# Altium schematic sheet TopLevel.SCHDOC
size A4
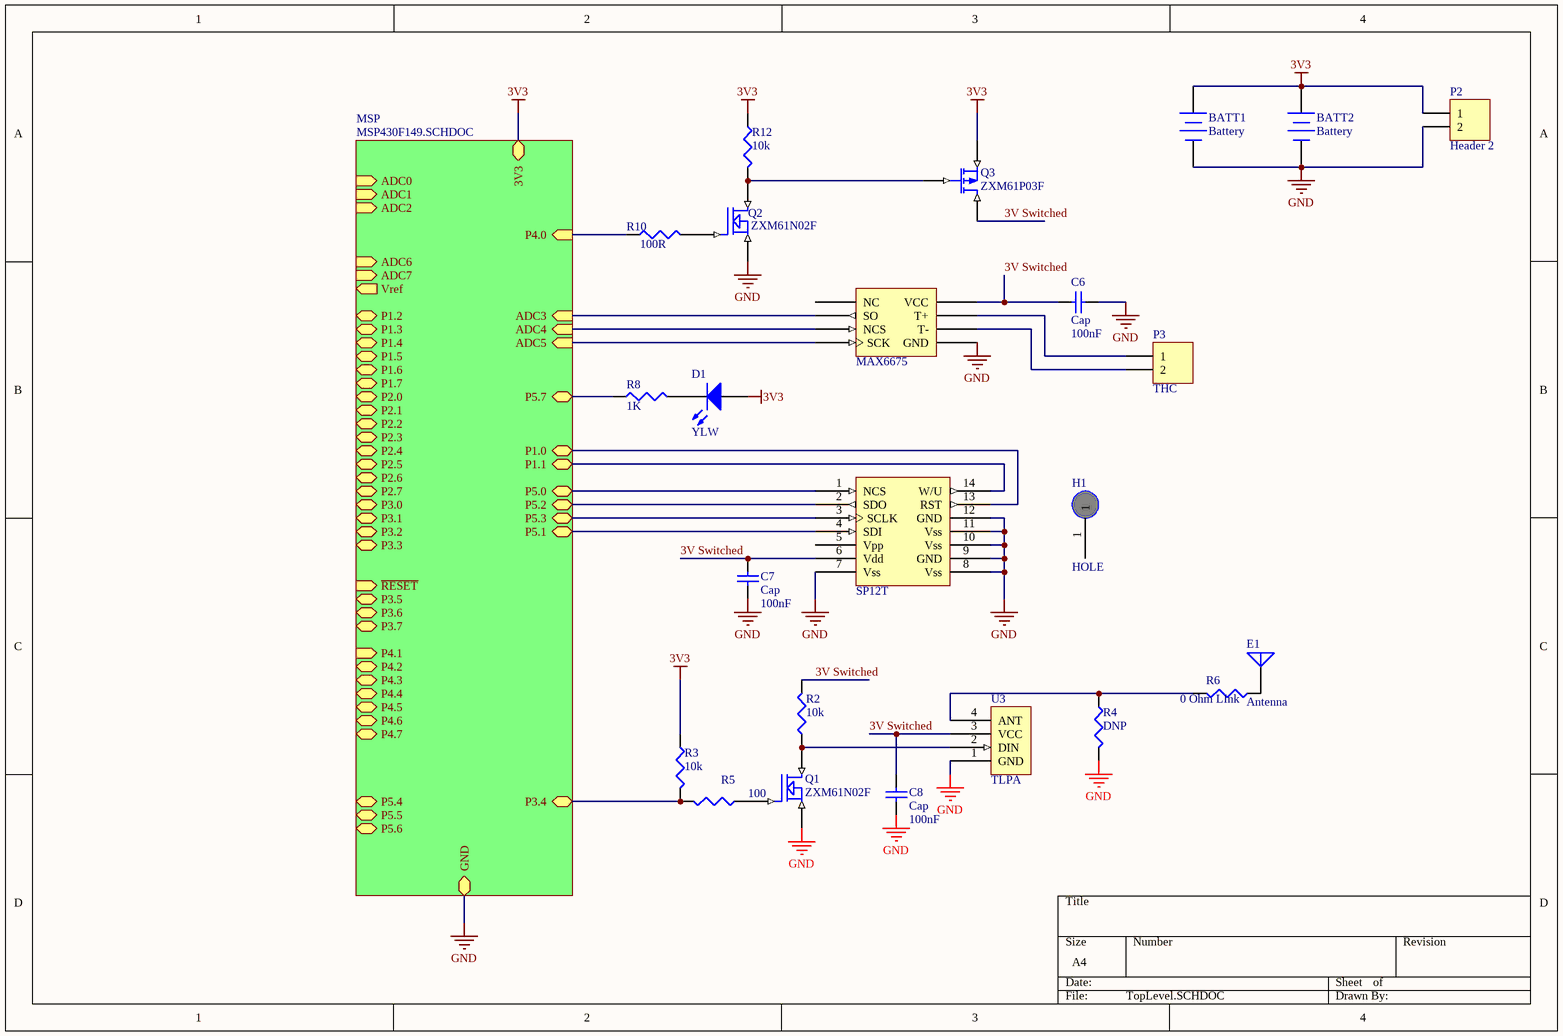
[diagram p0: TopLevel.SCHDOC]

## Parts
BATT1  Battery  [Keystone CR1632 Holder]
BATT2  Battery  [Keystone CR1632 Holder]
C6  Cap  value 100nF  [1608[0603]]
C7  Cap  value 100nF  [1608[0603]]
C8  Cap  value 100nF  [1608[0603]]
D1  YLW  [2012[0805]]
E1  Antenna  [PIN1]
H1  HOLE  [M2.5]
MAX6675  MAX6675  [SO8]  (value not drawn)
P2  Header 2  [HDR1X2]
P3  THC  [HDR1X2]
Q1  ZXM61N02F  [SOT23]
Q2  ZXM61N02F  [SOT23-3]
Q3  ZXM61P03F  [SOT23-3]
R2  10k  [1608[0603]]
R3  10k  [1608[0603]]
R4  DNP  [1608[0603]]
R5  100  [1608[0603]]
R6  0 Ohm LInk  [1608[0603]]
R8  1K  [1608[0603]]
R10  100R  [1608[0603]]
R12  10k  [1608[0603]]
SP12T  SP12T  [SOP14]  (value not drawn)
U3  TLPA  [TLPA Flat]

## Sub-sheets
MSP = MSP430F149.SCHDOC: GND, 3V3, ADC0 (in), ADC1 (in), ADC2 (in), ADC3 (in), ADC4 (in), ADC5 (in), ADC6 (in), ADC7 (in), P1.0, P1.1, P1.2, P1.3, P1.4, P1.5, P1.6, P1.7, P2.0, P2.1, P2.2, P2.3, P2.4, P2.5, P2.6, P2.7, P3.0, P3.1, P3.2, P3.3, P3.4, Vref (out), ~{RESET} (in), P3.5, P3.6, P3.7, P4.0 (in), P4.1 (in), P4.2, P4.3, P4.4, P4.5, P4.6, P4.7, P5.0, P5.1, P5.2, P5.3, P5.4, P5.5, P5.6, P5.7

## Nets
3V3: BATT1.1(+) BATT2.1(+) D1.1(A) P2.1 Q3.2(D) R3.1 R12.1 ; sheet MSP/3V3
GND: BATT1.2(-) BATT2.2(-) C6.2 C7.1 C8.1 MAX6675.1(GND) P2.2 Q1.2(S) Q2.2(S) R4.2 SP12T.7(Vss) SP12T.8(Vss) SP12T.9(GND) SP12T.10(Vss) SP12T.11(Vss) SP12T.12(GND) U3.1(GND) ; sheet MSP/GND
3V Switched: C6.1 C7.2 C8.2 MAX6675.4(VCC) Q3.3(S) R2.2 SP12T.6(Vdd) U3.3(VCC)
NetD1_2: D1.2(K) R8.2
NetE1_1: E1.1(A) R6.1
NetMAX6675_2: MAX6675.2(T-) P3.2
NetMAX6675_3: MAX6675.3(T+) P3.1
NetMAX6675_5: MAX6675.5(SCK) ; sheet MSP/ADC5
NetMAX6675_6: MAX6675.6(NCS) ; sheet MSP/ADC4
NetMAX6675_7: MAX6675.7(SO) ; sheet MSP/ADC3
NetQ1_1: Q1.1(G) R5.1
NetQ1_3: Q1.3(D) R2.1 U3.2(DIN)
NetQ2_1: Q2.1(G) R10.2
NetQ2_3: Q2.3(D) Q3.1(G) R12.2
NetR3_2: R3.2 R5.2 ; sheet MSP/P3.4
NetR4_1: R4.1 R6.2 U3.4(ANT)
NetR8_1: R8.1 ; sheet MSP/P5.7
NetR10_1: R10.1 ; sheet MSP/P4.0
NetSP12T_1: SP12T.1(NCS) ; sheet MSP/P5.0
NetSP12T_2: SP12T.2(SDO) ; sheet MSP/P5.2
NetSP12T_3: SP12T.3(SCLK) ; sheet MSP/P5.3
NetSP12T_4: SP12T.4(SDI) ; sheet MSP/P5.1
NetSP12T_13: SP12T.13(RST) ; sheet MSP/P1.0
NetSP12T_14: SP12T.14(W/U) ; sheet MSP/P1.1

Not connected (* = marked no-connect by the designer): H1 1; MAX6675 8(NC); SP12T 5(Vpp)

## Library data of the parts
BATT1 BATT2 = Battery: Multicell Battery; pin to pad: 1>0; Published: 24-Mar-1999; LatestRevisionDate: 17-Jul-2002; LatestRevisionNote: Re-released for DXP Platform.; PackageReference: BAT-2; Publisher: Altium Limited
C6-C8 = Cap: Capacitor; Published: 8-Jun-2000; LatestRevisionDate: 17-Jul-2002; LatestRevisionNote: Re-released for DXP Platform.; PackageReference: RAD-0.3; Publisher: Altium Limited
D1 = LED1: Typical RED GaAs LED; Published: 8-Jun-2000; LatestRevisionDate: 08-Jul-2005; LatestRevisionNote: Mech Layer 1 removed.; PackageReference: LED-1; Publisher: Altium Limited
E1 = Antenna: Generic Antenna; Published: 24-Mar-1999; Revision: July-2002: Re-released for DXP Platform.; Publisher: Altium Limited
MAX6675 = MAX6675: MAXIM 6675 SPI Thermocouple Amplifier
P2 P3 = Header 2: Header, 2-Pin; LatestRevisionDate: 17-Jul-2002; LatestRevisionNote: Re-released for DXP Platform.; Publisher: Altium Limited
Q1 Q2 = ZXM61N02F: 1.7A, 20V N-Channel Enhancement mode FET
  Q2: Farnell: 3256182; Price: 0.78
Q3 = ZXM61P03F: 1.1A, 30V P-Channel Enhancement mode FET; Farnell: 3256212; Price: 0.82
R2-R6 R8 R10 R12 = RES1: Resistor; Farnell: *
  R10 R12: Price: *
SP12T = SP12T: Pressure/Temperature sensor